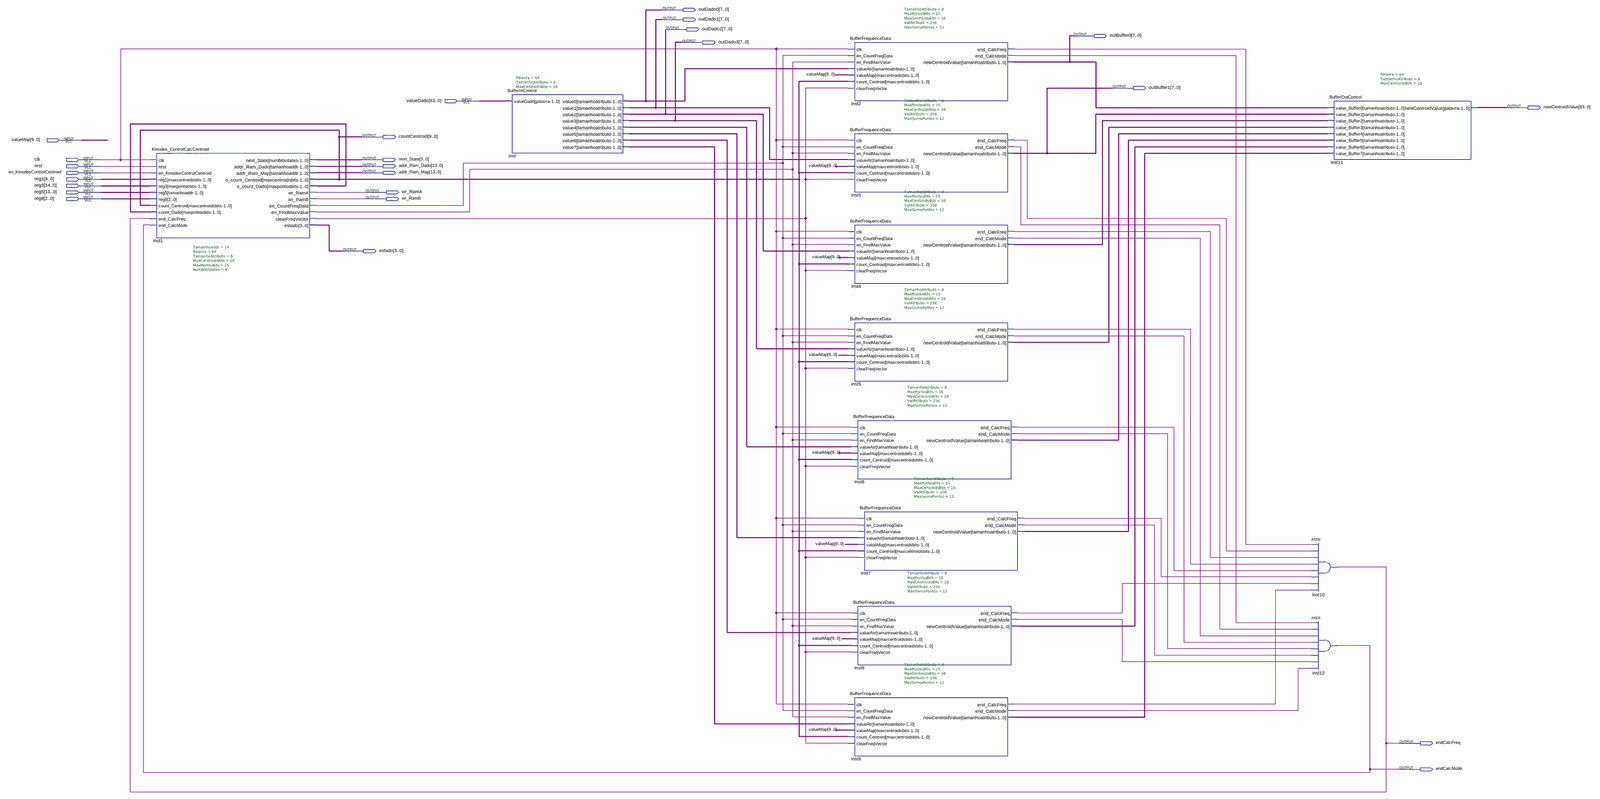
[diagram p0: schematic sheet, whole]
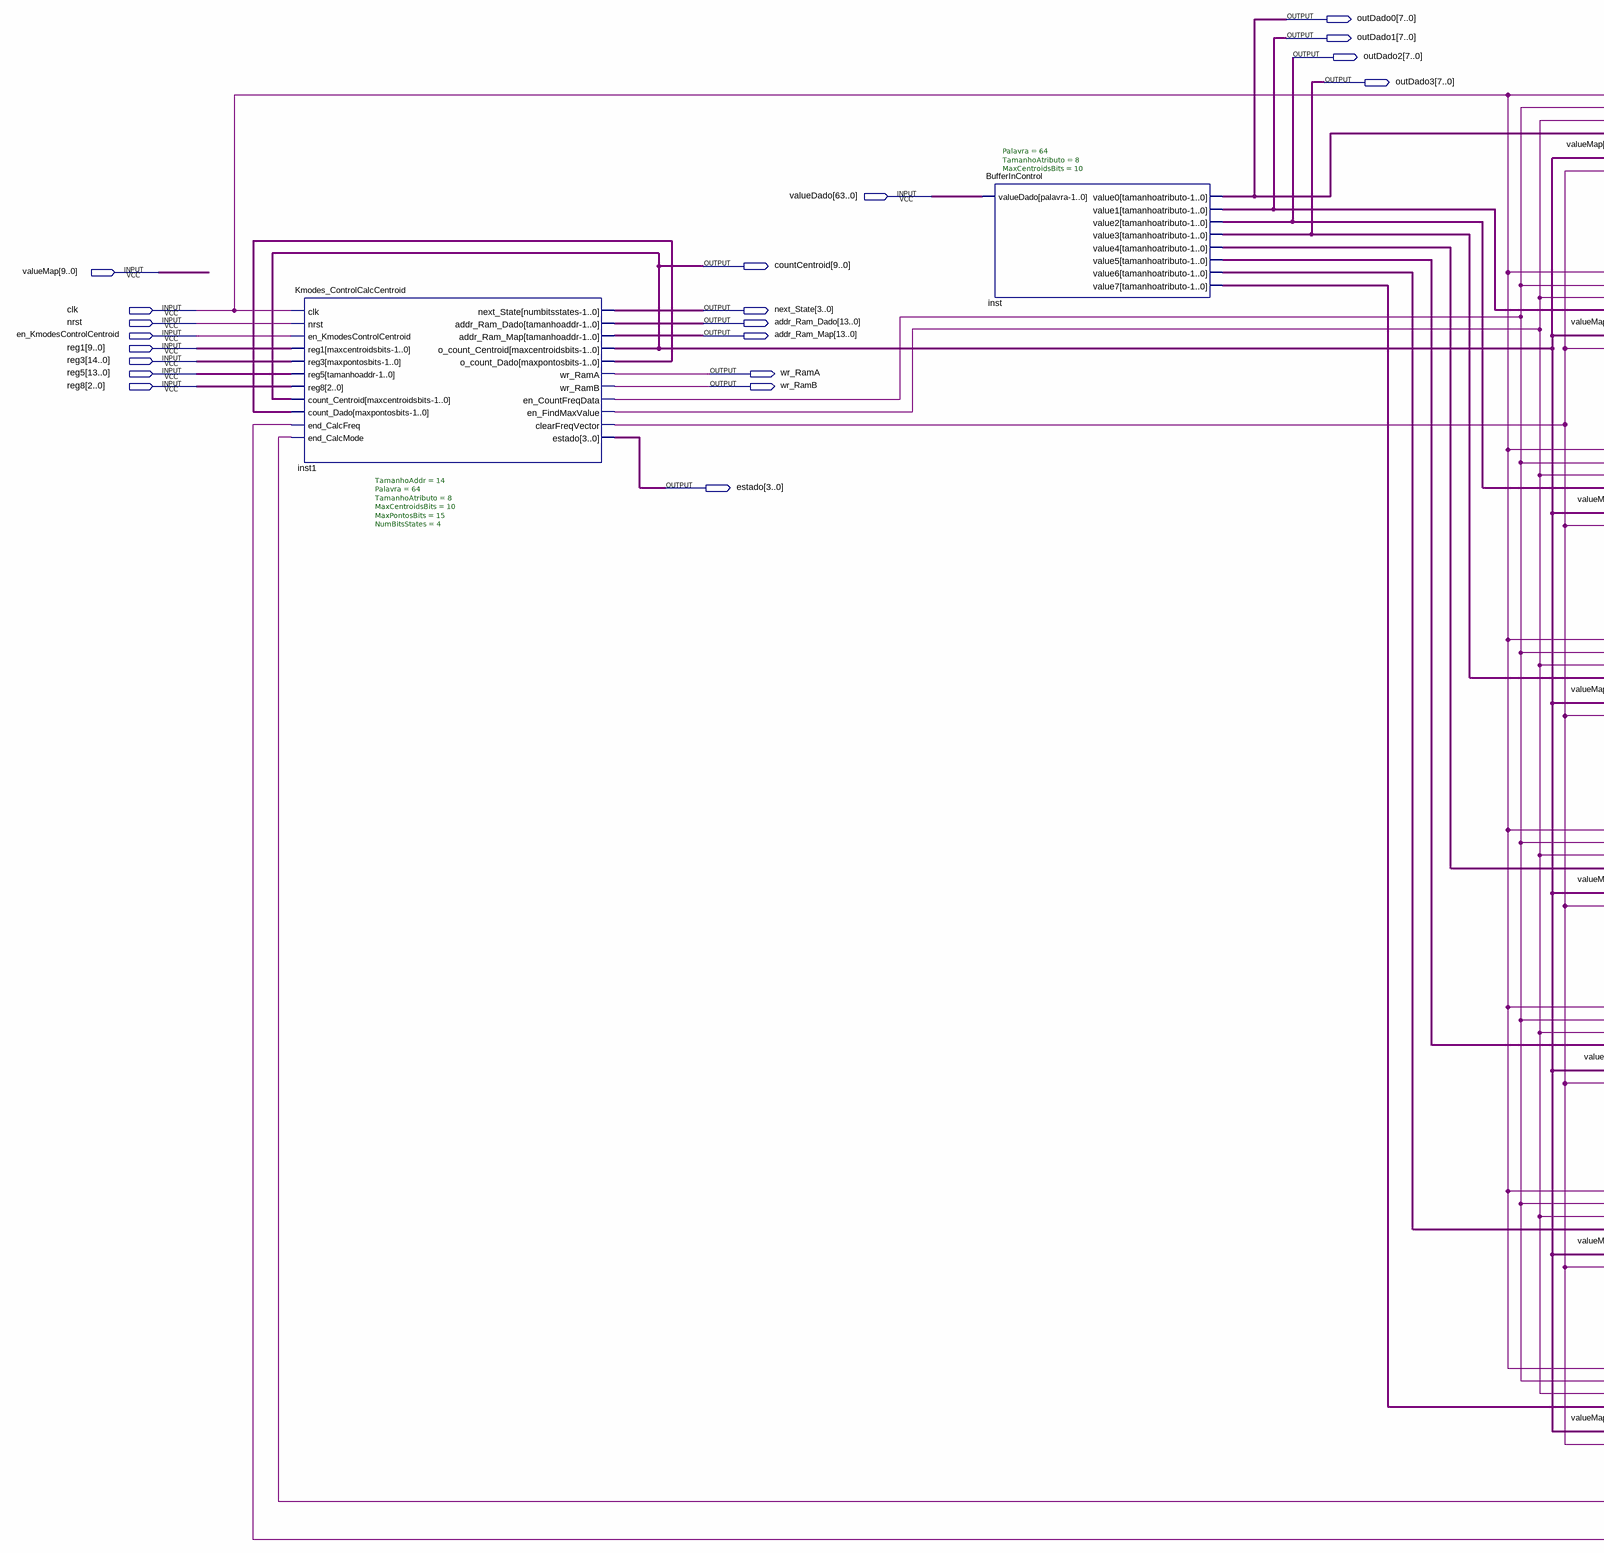
[diagram p1: schematic sheet, left part]
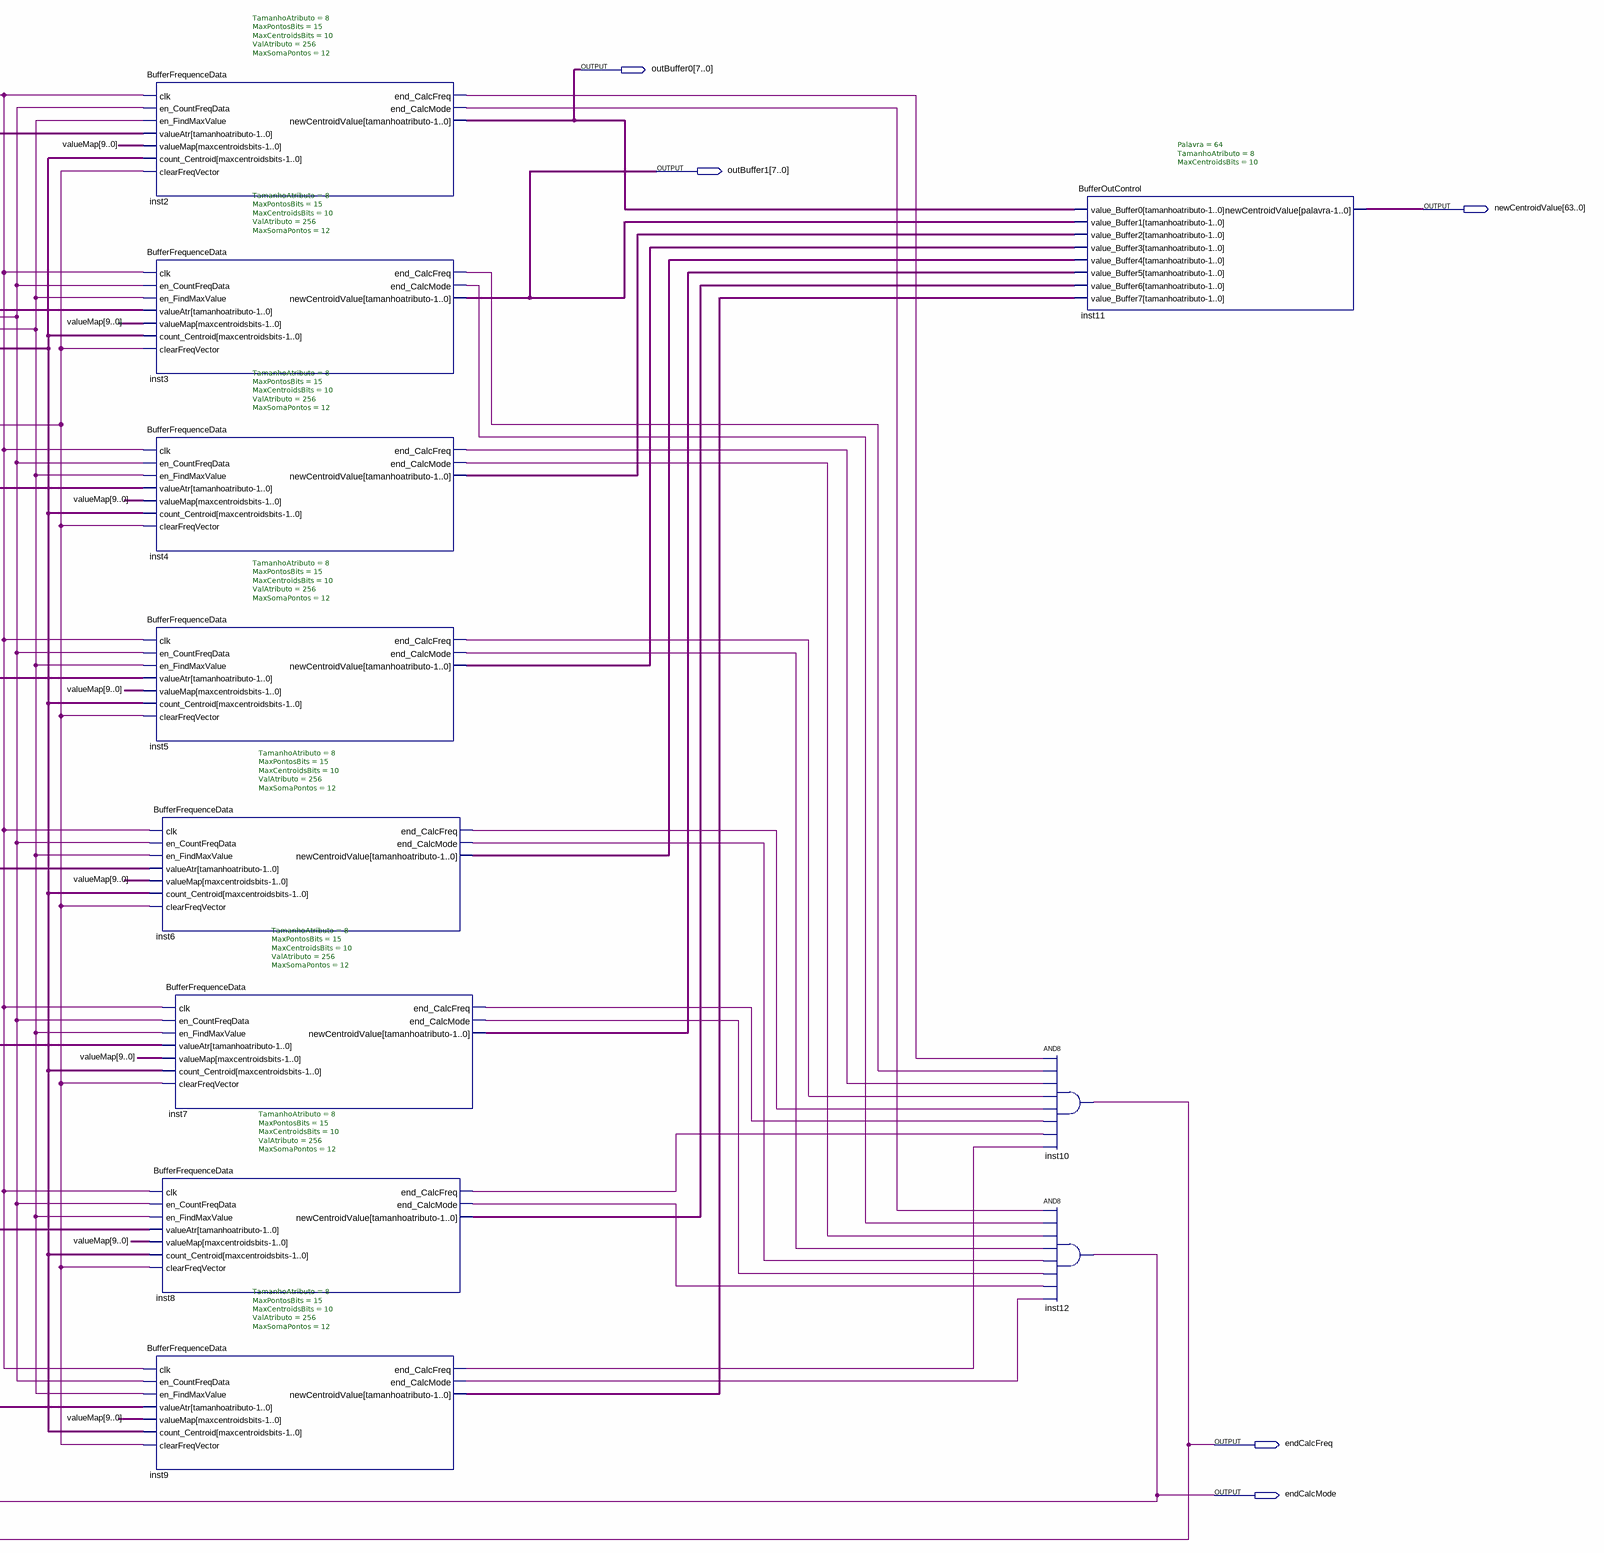
[diagram p2: schematic sheet, right part]
// Quartus schematic Kmodes_CalcCentroidModule.bdf as structural Verilog: 13 symbols, 25 pins
module Kmodes_CalcCentroidModule (
  input  [63:0] valueDado,
  input  [9:0] valueMap,
  input  clk,
  input  nrst,
  input  en_KmodesControlCentroid,
  input  [9:0] reg1,
  input  [14:0] reg3,
  input  [13:0] reg5,
  input  [2:0] reg8,
  output [7:0] outDado0,
  output [7:0] outDado1,
  output [7:0] outDado2,
  output [7:0] outBuffer0,
  output [7:0] outDado3,
  output [7:0] outBuffer1,
  output [63:0] newCentroidValue,
  output [9:0] countCentroid,
  output [3:0] next_State,
  output [13:0] addr_Ram_Dado,
  output [13:0] addr_Ram_Map,
  output wr_RamA,
  output wr_RamB,
  output [3:0] estado,
  output endCalcFreq,
  output endCalcMode
);

  wire inst1_clearfreqvector, inst1_en_countfreqdata, inst1_en_findmaxvalue, inst2_end_calcfreq,
       inst2_end_calcmode, inst3_end_calcfreq, inst3_end_calcmode, inst4_end_calcfreq, inst4_end_calcmode,
       inst5_end_calcfreq, inst5_end_calcmode, inst6_end_calcfreq, inst6_end_calcmode, inst7_end_calcfreq,
       inst7_end_calcmode, inst8_end_calcfreq, inst8_end_calcmode, inst9_end_calcfreq, inst9_end_calcmode;
  wire [7:0] inst4_newcentroidvalue, inst5_newcentroidvalue, inst6_newcentroidvalue, inst7_newcentroidvalue,
       inst8_newcentroidvalue, inst9_newcentroidvalue, inst_value4, inst_value5, inst_value6, inst_value7;
  wire [14:0] inst1_o_count_dado;

  Kmodes_ControlCalcCentroid #(.TamanhoAddr(14), .Palavra(64), .TamanhoAtributo(8), .MaxCentroidsBits(10), .MaxPontosBits(15), .NumBitsStates(4)) inst1 (
    .clk(clk), .nrst(nrst), .en_KmodesControlCentroid(en_KmodesControlCentroid), .reg1(reg1), .reg3(reg3),
    .reg5(reg5), .reg8(reg8), .count_Centroid(countCentroid), .count_Dado(inst1_o_count_dado),
    .end_CalcFreq(endCalcFreq), .end_CalcMode(endCalcMode), .next_State(next_State),
    .addr_Ram_Dado(addr_Ram_Dado), .addr_Ram_Map(addr_Ram_Map), .o_count_Centroid(countCentroid),
    .o_count_Dado(inst1_o_count_dado), .wr_RamA(wr_RamA), .wr_RamB(wr_RamB),
    .en_CountFreqData(inst1_en_countfreqdata), .en_FindMaxValue(inst1_en_findmaxvalue),
    .clearFreqVector(inst1_clearfreqvector), .estado(estado));
  BufferInControl #(.Palavra(64), .TamanhoAtributo(8), .MaxCentroidsBits(10)) inst (
    .valueDado(valueDado), .value0(outDado0), .value1(outDado1), .value2(outDado2), .value3(outDado3),
    .value4(inst_value4), .value5(inst_value5), .value6(inst_value6), .value7(inst_value7));
  BufferFrequenceData #(.TamanhoAtributo(8), .MaxPontosBits(15), .MaxCentroidsBits(10), .ValAtributo(256), .MaxSomaPontos(12)) inst2 (
    .clk(clk), .en_CountFreqData(inst1_en_countfreqdata), .en_FindMaxValue(inst1_en_findmaxvalue),
    .valueAtr(outDado0), .valueMap(valueMap), .count_Centroid(countCentroid),
    .clearFreqVector(inst1_clearfreqvector), .end_CalcFreq(inst2_end_calcfreq),
    .end_CalcMode(inst2_end_calcmode), .newCentroidValue(outBuffer0));
  BufferFrequenceData #(.TamanhoAtributo(8), .MaxPontosBits(15), .MaxCentroidsBits(10), .ValAtributo(256), .MaxSomaPontos(12)) inst3 (
    .clk(clk), .en_CountFreqData(inst1_en_countfreqdata), .en_FindMaxValue(inst1_en_findmaxvalue),
    .valueAtr(outDado1), .valueMap(valueMap), .count_Centroid(countCentroid),
    .clearFreqVector(inst1_clearfreqvector), .end_CalcFreq(inst3_end_calcfreq),
    .end_CalcMode(inst3_end_calcmode), .newCentroidValue(outBuffer1));
  BufferFrequenceData #(.TamanhoAtributo(8), .MaxPontosBits(15), .MaxCentroidsBits(10), .ValAtributo(256), .MaxSomaPontos(12)) inst4 (
    .clk(clk), .en_CountFreqData(inst1_en_countfreqdata), .en_FindMaxValue(inst1_en_findmaxvalue),
    .valueAtr(outDado2), .valueMap(valueMap), .count_Centroid(countCentroid),
    .clearFreqVector(inst1_clearfreqvector), .end_CalcFreq(inst4_end_calcfreq),
    .end_CalcMode(inst4_end_calcmode), .newCentroidValue(inst4_newcentroidvalue));
  BufferFrequenceData #(.TamanhoAtributo(8), .MaxPontosBits(15), .MaxCentroidsBits(10), .ValAtributo(256), .MaxSomaPontos(12)) inst5 (
    .clk(clk), .en_CountFreqData(inst1_en_countfreqdata), .en_FindMaxValue(inst1_en_findmaxvalue),
    .valueAtr(outDado3), .valueMap(valueMap), .count_Centroid(countCentroid),
    .clearFreqVector(inst1_clearfreqvector), .end_CalcFreq(inst5_end_calcfreq),
    .end_CalcMode(inst5_end_calcmode), .newCentroidValue(inst5_newcentroidvalue));
  BufferFrequenceData #(.TamanhoAtributo(8), .MaxPontosBits(15), .MaxCentroidsBits(10), .ValAtributo(256), .MaxSomaPontos(12)) inst9 (
    .clk(clk), .en_CountFreqData(inst1_en_countfreqdata), .en_FindMaxValue(inst1_en_findmaxvalue),
    .valueAtr(inst_value7), .valueMap(valueMap), .count_Centroid(countCentroid),
    .clearFreqVector(inst1_clearfreqvector), .end_CalcFreq(inst9_end_calcfreq),
    .end_CalcMode(inst9_end_calcmode), .newCentroidValue(inst9_newcentroidvalue));
  BufferFrequenceData #(.TamanhoAtributo(8), .MaxPontosBits(15), .MaxCentroidsBits(10), .ValAtributo(256), .MaxSomaPontos(12)) inst6 (
    .clk(clk), .en_CountFreqData(inst1_en_countfreqdata), .en_FindMaxValue(inst1_en_findmaxvalue),
    .valueAtr(inst_value4), .valueMap(valueMap), .count_Centroid(countCentroid),
    .clearFreqVector(inst1_clearfreqvector), .end_CalcFreq(inst6_end_calcfreq),
    .end_CalcMode(inst6_end_calcmode), .newCentroidValue(inst6_newcentroidvalue));
  BufferFrequenceData #(.TamanhoAtributo(8), .MaxPontosBits(15), .MaxCentroidsBits(10), .ValAtributo(256), .MaxSomaPontos(12)) inst7 (
    .clk(clk), .en_CountFreqData(inst1_en_countfreqdata), .en_FindMaxValue(inst1_en_findmaxvalue),
    .valueAtr(inst_value5), .valueMap(valueMap), .count_Centroid(countCentroid),
    .clearFreqVector(inst1_clearfreqvector), .end_CalcFreq(inst7_end_calcfreq),
    .end_CalcMode(inst7_end_calcmode), .newCentroidValue(inst7_newcentroidvalue));
  BufferFrequenceData #(.TamanhoAtributo(8), .MaxPontosBits(15), .MaxCentroidsBits(10), .ValAtributo(256), .MaxSomaPontos(12)) inst8 (
    .clk(clk), .en_CountFreqData(inst1_en_countfreqdata), .en_FindMaxValue(inst1_en_findmaxvalue),
    .valueAtr(inst_value6), .valueMap(valueMap), .count_Centroid(countCentroid),
    .clearFreqVector(inst1_clearfreqvector), .end_CalcFreq(inst8_end_calcfreq),
    .end_CalcMode(inst8_end_calcmode), .newCentroidValue(inst8_newcentroidvalue));
  and inst10 (endCalcFreq, inst2_end_calcfreq, inst3_end_calcfreq, inst4_end_calcfreq, inst5_end_calcfreq, inst6_end_calcfreq, inst7_end_calcfreq, inst8_end_calcfreq, inst9_end_calcfreq);
  and inst12 (endCalcMode, inst2_end_calcmode, inst3_end_calcmode, inst4_end_calcmode, inst5_end_calcmode, inst6_end_calcmode, inst7_end_calcmode, inst8_end_calcmode, inst9_end_calcmode);
  BufferOutControl #(.Palavra(64), .TamanhoAtributo(8), .MaxCentroidsBits(10)) inst11 (
    .value_Buffer0(outBuffer0), .value_Buffer1(outBuffer1), .value_Buffer2(inst4_newcentroidvalue),
    .value_Buffer3(inst5_newcentroidvalue), .value_Buffer4(inst6_newcentroidvalue),
    .value_Buffer5(inst7_newcentroidvalue), .value_Buffer6(inst8_newcentroidvalue),
    .value_Buffer7(inst9_newcentroidvalue), .newCentroidValue(newCentroidValue));
endmodule
